# Altium schematic sheet Shore Power.SchDoc
size A4
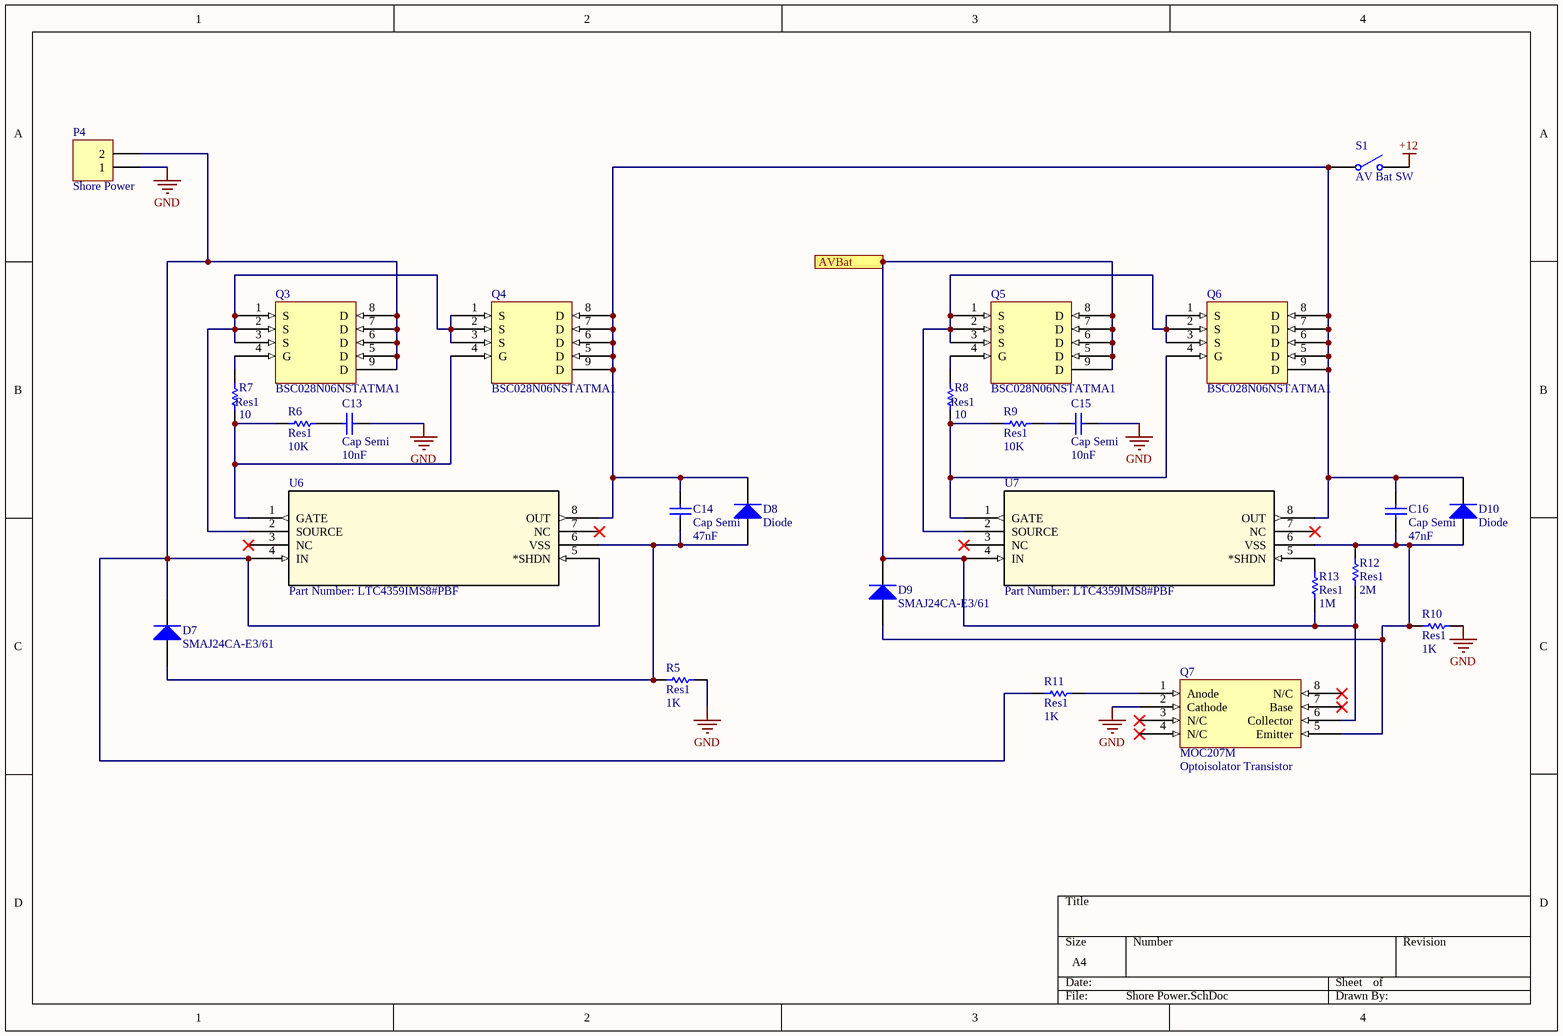
[diagram p0: Shore Power.SchDoc]

## Parts
C13  Cap Semi  value 10nF  [C1206]
C14  Cap Semi  value 47nF  [C1206]
C15  Cap Semi  value 10nF  [C1206]
C16  Cap Semi  value 47nF  [C1206]
D7  SMAJ24CA-E3/61  [DIODE_DO-214AC]
D8  Diode  [DIOM4427X27N]
D9  SMAJ24CA-E3/61  [DIODE_DO-214AC]
D10  Diode  [DIOM4427X27N]
P4  Shore Power  [M80-5000000M5-02-333-00-000]
Q3  BSC028N06NSTATMA1  [FDMS86101A]
Q4  BSC028N06NSTATMA1  [FDMS86101A]
Q5  BSC028N06NSTATMA1  [FDMS86101A]
Q6  BSC028N06NSTATMA1  [FDMS86101A]
Q7  MOC207M  [SOIC127P590X363-8N]
R5  Res1  value 1K  [STA_RMCF2512]
R6  Res1  value 10K  [6-0805_L]
R7  Res1  value 10  [6-0805_L]
R8  Res1  value 10  [6-0805_L]
R9  Res1  value 10K  [6-0805_L]
R10  Res1  value 1K  [STA_RMCF2512]
R11  Res1  value 1K  [STA_RMCF2512]
R12  Res1  value 2M  [J1-0603]
R13  Res1  value 1M  [J1-0603]
S1  AV Bat SW  [M80-5000000M5-02-333-00-000]
U6  Part Number: LTC4359IMS8#PBF  [MSOP-8_MS]
U7  Part Number: LTC4359IMS8#PBF  [MSOP-8_MS]

## Ports
AVBat

## Nets
+12: S1.2(NO)
GND: C13.1 C15.1 P4.1 Q7.2(Cathode) R5.1 R10.1
AVBat: D9.2(K) Q5.5(D) Q5.6(D) Q5.7(D) Q5.8(D) Q5.9(D) Q7.6(Collector) R12.1 R13.2 U7.4(IN) ; port AVBat
NetC13_2: C13.2 R6.2
NetC14_1: C14.1 C16.1 D8.2(K) D10.2(K) Q4.5(D) Q4.6(D) Q4.7(D) Q4.8(D) Q4.9(D) Q6.5(D) Q6.6(D) Q6.7(D) Q6.8(D) Q6.9(D) S1.1(COMMON) U6.8(OUT) U7.8(OUT)
NetC14_2: C14.2 D7.1(A) D8.1(A) R5.2 U6.6(VSS)
NetC15_2: C15.2 R9.2
NetC16_2: C16.2 D9.1(A) D10.1(A) Q7.5(Emitter) R10.2 R12.2 U7.6(VSS)
NetD7_2: D7.2(K) P4.2 Q3.5(D) Q3.6(D) Q3.7(D) Q3.8(D) Q3.9(D) R11.2 U6.4(IN) U6.5(*SHDN)
NetQ3_1: Q3.1(S) Q3.2(S) Q3.3(S) Q4.1(S) Q4.2(S) Q4.3(S) U6.2(SOURCE)
NetQ3_4: Q3.4(G) R7.2
NetQ4_4: Q4.4(G) R6.1 R7.1 U6.1(GATE)
NetQ5_1: Q5.1(S) Q5.2(S) Q5.3(S) Q6.1(S) Q6.2(S) Q6.3(S) U7.2(SOURCE)
NetQ5_4: Q5.4(G) R8.2
NetQ6_4: Q6.4(G) R8.1 R9.1 U7.1(GATE)
NetQ7_1: Q7.1(Anode) R11.1
NetR13_1: R13.1 U7.5(*SHDN)

Not connected (* = marked no-connect by the designer): Q7 3(N/C)* 4(N/C)* 7(Base)* 8(N/C)*; U6 3(NC)* 7(NC)*; U7 3(NC)* 7(NC)*

## Library data of the parts
C13-C16 = Cap Semi: Capacitor (Semiconductor SIM Model); Published: 8-Jun-2000; LatestRevisionDate: 29-May-2009; LatestRevisionNote: IPC-7351 Footprint Added.; PackageReference: C1206; Publisher: Altium Limited; PackageDescription: Chip Capacitor
  C13 C15: Supplier Part Number: 1276-2735-1-ND
  C14 C16: Supplier Part Number: 311-4451-1-ND
D7 D9 = Diode: Default Diode; SPN: SMAJ24CA-E3/61GICT-ND; Published: 8-Jun-2000; LatestRevisionDate: 17-Jul-2002; LatestRevisionNote: Re-released for DXP Platform.; PackageVersion: Sep-1996; PackageReference: SMC; Publisher: Altium Limited; PackageDescription: DO-214-AB/SMC; 2 C-Bend Leads; Body 7.9 x 5.9 mm, inc. leads (LxW); Code_JEDEC: DO-214-AB
D8 D10 = Diode: Default Diode; pin to pad: 1>2 2>1; Published: 8-Jun-2000; LatestRevisionDate: 17-Jul-2002; LatestRevisionNote: Re-released for DXP Platform.; PackageVersion: Sep-1996; PackageReference: SMC; Publisher: Altium Limited; PackageDescription: DO-214-AB/SMC; 2 C-Bend Leads; Body 7.9 x 5.9 mm, inc. leads (LxW); Code_JEDEC: DO-214-AB
P4 = Header 2: Header, 2-Pin; LatestRevisionDate: 17-Jul-2002; LatestRevisionNote: Re-released for DXP Platform.; Publisher: Altium Limited
Q3-Q6 = FDMS86101A: MOSFET N-CH 100V 13A POWER56; SPN: BSC028N06NSTATMA1CT-ND
Q7 = MOC207M: Optoisolator Transistor; SPN: MOC207M-ND; Desc: Optoisolator Transistor
R5 R10 R11 = Res1: Resistor; SPN: RMCF2512JT1K00CT-ND; Published: 8-Jun-2000; LatestRevisionDate: 17-Jul-2002; LatestRevisionNote: Re-released for DXP Platform.; PackageReference: AXIAL-0.3; Publisher: Altium Limited; PackageDescription: Axial Device, Thru-Hole; 2 Leads; 0.3 in Pin Spacing
R6 R9 = Res1: Resistor; SPN: RNCP0805FTD10K0CT-ND; Published: 8-Jun-2000; LatestRevisionDate: 17-Jul-2002; LatestRevisionNote: Re-released for DXP Platform.; PackageReference: AXIAL-0.3; Publisher: Altium Limited; PackageDescription: Axial Device, Thru-Hole; 2 Leads; 0.3 in Pin Spacing
R7 R8 = Res1: Resistor; SPN: RHM10.0AECT-ND; Published: 8-Jun-2000; LatestRevisionDate: 17-Jul-2002; LatestRevisionNote: Re-released for DXP Platform.; PackageReference: AXIAL-0.3; Publisher: Altium Limited; PackageDescription: Axial Device, Thru-Hole; 2 Leads; 0.3 in Pin Spacing
R12 = Res1: Resistor; SPN: RHM2MDCT-ND; Published: 8-Jun-2000; LatestRevisionDate: 17-Jul-2002; LatestRevisionNote: Re-released for DXP Platform.; PackageReference: AXIAL-0.3; Publisher: Altium Limited; PackageDescription: Axial Device, Thru-Hole; 2 Leads; 0.3 in Pin Spacing
R13 = Res1: Resistor; SPN: RHM1MDCT-ND; Published: 8-Jun-2000; LatestRevisionDate: 17-Jul-2002; LatestRevisionNote: Re-released for DXP Platform.; PackageReference: AXIAL-0.3; Publisher: Altium Limited; PackageDescription: Axial Device, Thru-Hole; 2 Leads; 0.3 in Pin Spacing
S1 = SW-SPST: Single-Pole, Single-Throw Switch; Published: 24-Mar-1999; LatestRevisionDate: 17-Jul-2002; LatestRevisionNote: Re-released for DXP Platform.; PackageReference: SPST-2; Publisher: Altium Limited; PackageDescription: Switch; 2 Leads
U6 U7 = LTC4359IMS8#PBF: No Description Available; Vendor: Linear Technology; Built_By: EMA_UL_Team; Manufacturer_Part_Number: LTC4359IMS8#PBF; Copyright: Copyright (C) 2018 Accelerated Designs. All rights reserved; RefDes: RefDes; Type: DEV; Value: Value